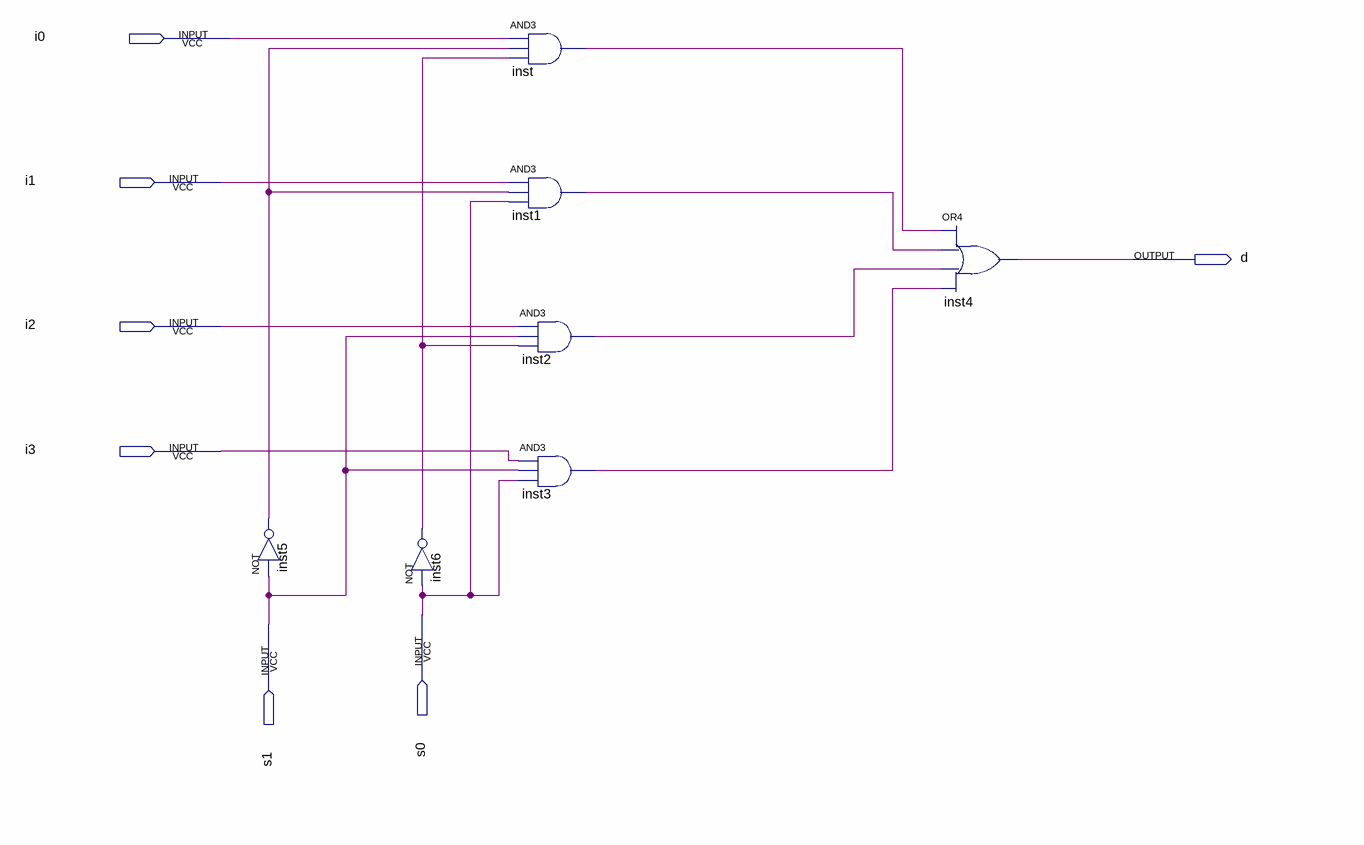
[diagram p0: schematic sheet]
// Quartus schematic multiplexer.bdf as structural Verilog: 7 symbols, 7 pins
module multiplexer (
  input  i0,
  input  i1,
  input  i2,
  input  i3,
  input  s0,
  input  s1,
  output d
);

  wire inst1_out, inst2_out, inst3_out, inst5_out, inst6_out, inst_out;

  not inst5 (inst5_out, s1);
  not inst6 (inst6_out, s0);
  and inst (inst_out, i0, inst5_out, inst6_out);
  and inst1 (inst1_out, i1, inst5_out, s0);
  and inst2 (inst2_out, i2, s1, inst6_out);
  and inst3 (inst3_out, i3, s1, s0);
  or inst4 (d, inst_out, inst1_out, inst2_out, inst3_out);
endmodule
